# EAGLE design Controller (EAGLE 7.1.0)
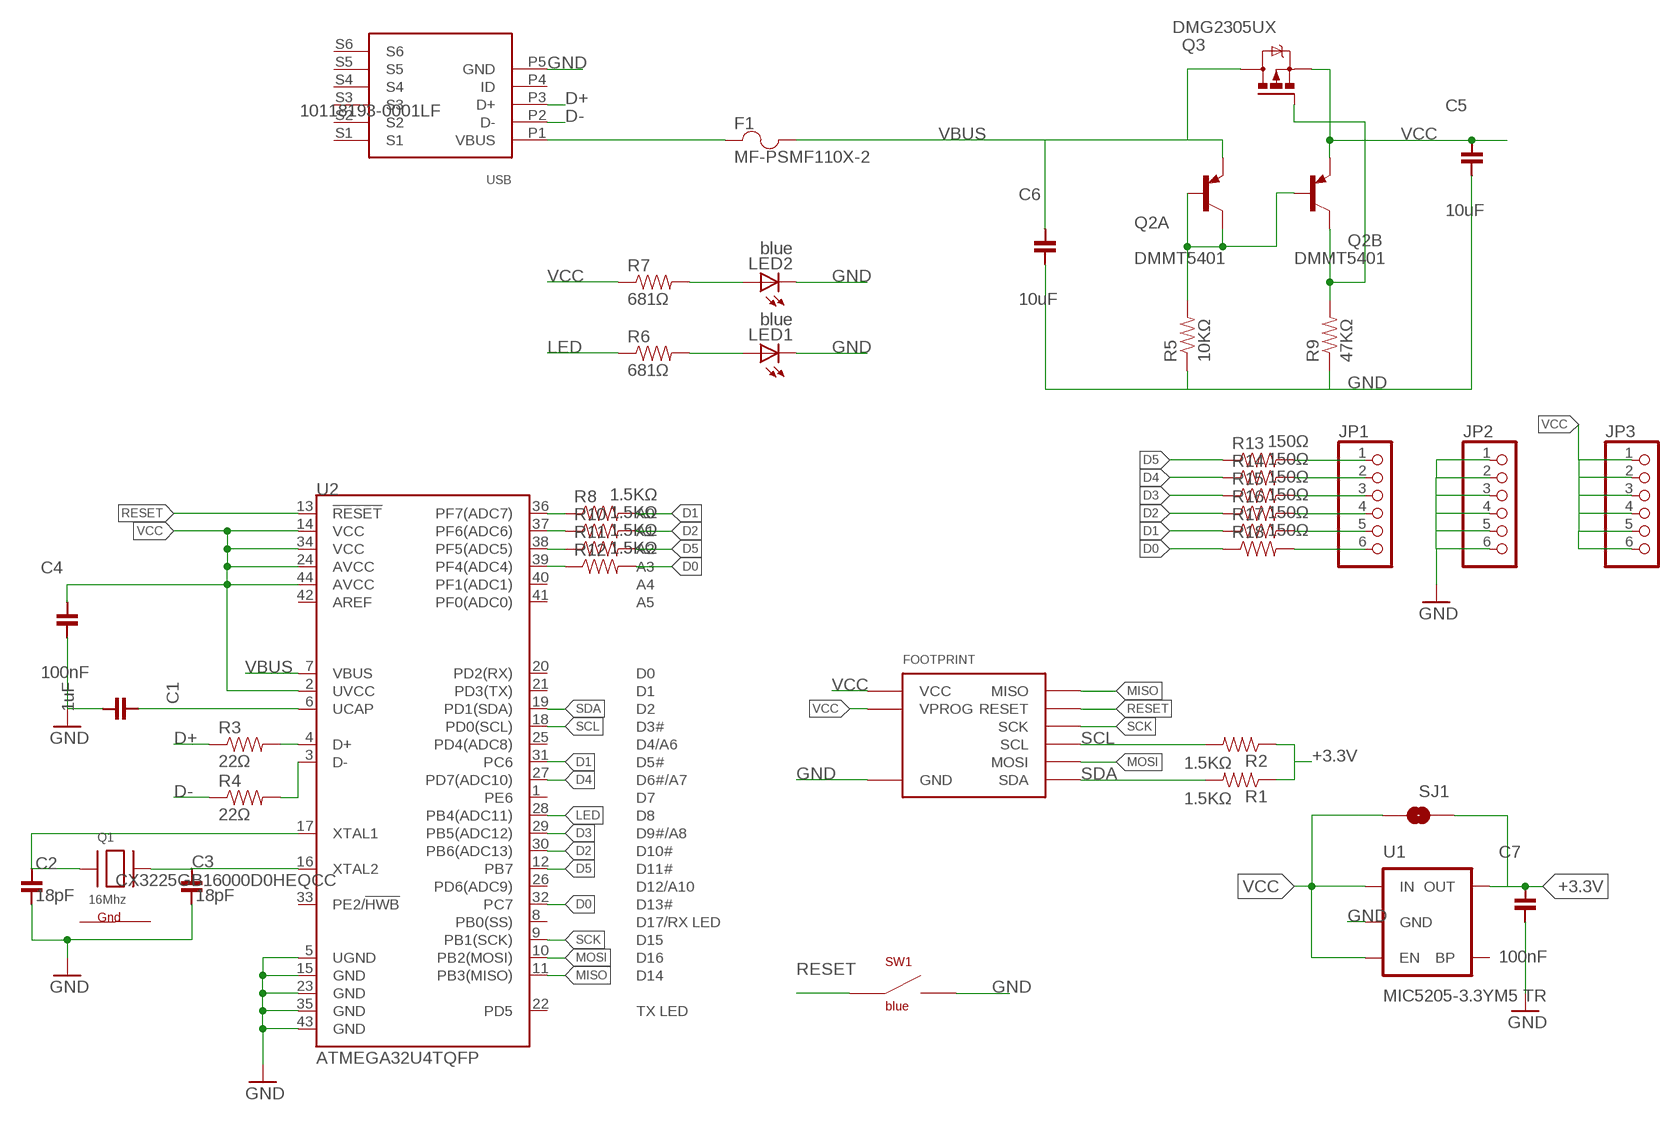
[diagram p0: schematic, sheet 1]

## Parts
C1  1uF  CAPACITOR-1UF  [0603]
C2  18pF  CAPACITOR-18PF  [0603]
C3  18pF  CAPACITOR-18PF  [0603]
C4  100nF  CAPACITOR-100NF  [0603]
C5  10uF  CAPACITOR-10UF  [0603]
C6  10uF  CAPACITOR-10UF  [0603]
C7  100nF  CAPACITOR-100NF  [0603]
F1  MF-PSMF110X-2  FUSE  [0805]
FOOTPRINT  DEVICE-PCB-TABS  [DEVICE-PCB-TABS]
JP1  PINHD-1X6LOCK  [1X06-BIGLOCK]
JP2  PINHD-1X6LOCK  [1X06-BIGLOCK]
JP3  PINHD-1X6LOCK  [1X06-BIGLOCK]
LED1  blue  LED-0805-BLUE  [0805-LED]
LED2  blue  LED-0805-BLUE  [0805-LED]
Q1  16Mhz  CRYSTAL-NX3225  [NX3225]
Q2  DMMT5401  TRANSISTOR-DUAL-PNP  [SOT-26]
Q3  DMG2305UX  IRLML5203  [MICRO3]
R1  1.5KΩ  RESISTOR-1.5KΩ  [0603]
R2  1.5KΩ  RESISTOR-1.5KΩ  [0603]
R3  22Ω  RESISTOR-22Ω  [0603]
R4  22Ω  RESISTOR-22Ω  [0603]
R5  10KΩ  RESISTOR-10KΩ  [0603]
R6  681Ω  RESISTOR-681Ω  [0603]
R7  681Ω  RESISTOR-681Ω  [0603]
R8  1.5KΩ  RESISTOR-1.5KΩ  [0603]
R9  47KΩ  RESISTOR-47KΩ  [0603]
R10  1.5KΩ  RESISTOR-1.5KΩ  [0603]
R11  1.5KΩ  RESISTOR-1.5KΩ  [0603]
R12  1.5KΩ  RESISTOR-1.5KΩ  [0603]
R13  150Ω  RESISTOR-150Ω  [0603]
R14  150Ω  RESISTOR-150Ω  [0603]
R15  150Ω  RESISTOR-150Ω  [0603]
R16  150Ω  RESISTOR-150Ω  [0603]
R17  150Ω  RESISTOR-150Ω  [0603]
R18  150Ω  RESISTOR-150Ω  [0603]
SJ1  SOLDERJUMPERNO  [SJ_2S-NO]
SW1  blue  SWITCHBOURNS-7914J  [BOURNS-7914J]
U1  MIC5205-3.3YM5 TR  VREG-MIC5205-3.3V  [SOT23-5]
U2  ATMEGA32U4TQFP  [SPARKFUN-DIGITALIC_TQFP44]
U3  USBFCI-MICROB  [USB-MICROB-FCI]

## Nets
+3.3V: C7.1 R1.1 R2.1 SJ1.2 U1.5(OUT)
D0: R12.2 R18.1 U2.32(PC7)
D1: R8.2 R17.1 U2.31(PC6)
D2: R10.2 R16.1 U2.30(PB6(ADC13))
D3: R15.1 U2.29(PB5(ADC12))
D4: R14.1 U2.27(PD7(ADC10))
D5: R11.2 R13.1 U2.12(PB7)
D+: R3.1 U3.P3(D+)
D-: R4.1 U3.P2(D-)
GND: C1.2 C2.2 C3.2 C4.2 C5.2 C6.2 C7.2 FOOTPRINT.BUS0(GND) JP2.1 JP2.2 JP2.3 JP2.4 JP2.5 JP2.6 LED1.C LED2.C R5.1 R9.1 SW1.NEG$1(NEG1) SW1.NEG$2(NEG1) U1.2(GND) U2.5(UGND) U2.15(GND) U2.23(GND) U2.35(GND) U2.43(GND) U3.P5(GND)
LED: R6.1 U2.28(PB4(ADC11))
MISO: FOOTPRINT.PROG3(MISO) U2.11(PB3(MISO))
MOSI: FOOTPRINT.PROG4(MOSI) U2.10(PB2(MOSI))
N$1: C1.1 U2.6(UCAP)
N$2: JP1.1 R13.2
N$3: F1.1 U3.P1(VBUS)
N$4: C3.1 Q1.3(X2) U2.16(XTAL2)
N$5: LED1.A R6.2
N$6: R12.1 U2.39(PF4(ADC4))
N$7: R11.1 U2.38(PF5(ADC5))
N$8: R3.2 U2.4(D+)
N$9: R4.2 U2.3(D-)
N$10: R10.1 U2.37(PF6(ADC6))
N$11: R8.1 U2.36(PF7(ADC7))
N$12: LED2.A R7.2
N$13: JP1.2 R14.2
N$14: Q2.1(A:C) Q2.2(A:B) Q2.3(B:B) R5.2
N$15: C2.1 Q1.1(X1) U2.17(XTAL1)
N$16: Q2.4(B:C) Q3.1(G) R9.2
N$17: JP1.3 R15.2
N$18: JP1.4 R16.2
N$19: JP1.5 R17.2
N$20: JP1.6 R18.2
RESET: FOOTPRINT.PROG1(RESET) SW1.POS$1(POS1) SW1.POS$2(POS1) U2.13(!RESET)
SCK: FOOTPRINT.PROG2(SCK) U2.9(PB1(SCK))
SCL: FOOTPRINT.BUS3(SCL) R2.2 U2.18(PD0(SCL))
SDA: FOOTPRINT.BUS1(SDA) R1.2 U2.19(PD1(SDA))
VBUS: C6.1 F1.2 Q2.6(A:E) Q3.3(D) U2.7(VBUS)
VCC: C4.1 C5.1 FOOTPRINT.BUS2(VCC) FOOTPRINT.PROG0(VPROG) JP3.1 JP3.2 JP3.3 JP3.4 JP3.5 JP3.6 Q2.5(B:E) Q3.2(S) R7.1 SJ1.1 U1.1(IN) U1.3(EN) U2.2(UVCC) U2.14(VCC) U2.24(AVCC) U2.34(VCC) U2.44(AVCC)
Unconnected: U1.4(BP) U2.1(PE6) U2.8(PB0(SS)) U2.20(PD2(RX)) U2.21(PD3(TX)) U2.22(PD5) U2.25(PD4(ADC8)) U2.26(PD6(ADC9)) U2.33(PE2/!HWB) U2.40(PF1(ADC1)) U2.41(PF0(ADC0)) U2.42(AREF) U3.P4(ID) U3.S1 U3.S2 U3.S3 U3.S4 U3.S5 U3.S6

## Power pins joined to a net without a drawn wire
G1: Q1.2(G1)
G2: Q1.4(G2)

## Library data of the parts
C1 = Modulo:CAPACITOR: Capacitor; PARTNUM: C0603C105K4RACTU
C2 C3 = Modulo:CAPACITOR: Capacitor; PARTNUM: C0603C180J5GACTU
C4 C7 = Modulo:CAPACITOR: Capacitor; PARTNUM: C0603C104K5RACTU
C5 C6 = Modulo:CAPACITOR: Capacitor; PARTNUM: GRM188R60J106ME47D
F1 = Modulo:FUSE; PARTNUM: MF-PSFM110X-2
FOOTPRINT = Modulo:DEVICE-PCB: Modulo Footprint
JP1-JP3 = adafruit:PINHD-1X6: PIN HEADER; PARTNUM: PREC006SAAN-RC
LED1 LED2 = Modulo:LED: LED; PARTNUM: LTST-C171TBKT
Q1 = Modulo:CRYSTAL; PARTNUM: CX3225GB16000D0HEQCC
Q2 = IntegerLabs:TRANSISTOR-DUAL-PNP: PNP Transistor; PARTNUM: DMMT5401
Q3 = transistor-power:IRLML5203: HEXFET P-Channel Power MOSFET; PARTNUM: DMG2305UX
R1 R2 R8 R10-R12 = Modulo:RESISTOR: Resistor Basic schematic elements and footprints for 0603, 1206, and PTH resistors.; PARTNUM: ERJ-3EKF1501V
R3 R4 = Modulo:RESISTOR: Resistor Basic schematic elements and footprints for 0603, 1206, and PTH resistors.; PARTNUM: ERJ-3EKF22R0V
R5 = Modulo:RESISTOR: Resistor Basic schematic elements and footprints for 0603, 1206, and PTH resistors.; PARTNUM: ERJ-3EKF1002V
R6 R7 = Modulo:RESISTOR: Resistor Basic schematic elements and footprints for 0603, 1206, and PTH resistors.; PARTNUM: ERJ-3EKF6810V
R9 = Modulo:RESISTOR: Resistor Basic schematic elements and footprints for 0603, 1206, and PTH resistors.; PARTNUM: ERJ-3EKF4702V
R13-R18 = Modulo:RESISTOR: Resistor Basic schematic elements and footprints for 0603, 1206, and PTH resistors.; PARTNUM: ERJ-3EKF1500V
SJ1 = SparkFun-Passives:SOLDERJUMPER: Solder Jumper Standard SMD solder jumper. Used to automate production. Two varients : Normally Open and Normally Closed are the same, but have different paste layers. NC will have a large amount of paste and should jumper during reflow.; PARTNUM: EXCLUDE
SW1 = Modulo:SWITCH; PARTNUM: 7914J-1-000E
U1 = Modulo:VREG-MIC5205: V_REG MIC5219 Standard 3.3V and 5V 150mA LDO voltage regulator in SOT-23 layout. Micrel part MIC5205. BP (by-pass) pin is used to lower output noise with 470pF cap, may be left open.; PARTNUM: MIC5205-3.3YM5 TR
U2 = SparkFun-DigitalIC:ATMEGA32U4: Atmel 44-pin 8-bit Microcontroller with 32KBytes of ISP Flash and USB Controller ----- Please use the QFN-44-NOPAD_1:1 package for the footprint of all boards using a 32U4. Route traces directly away from the pads as much as possible.; PARTNUM: ATMEGA32U4TQFP; PROD_ID: IC-11161
U3 = IntegerLabs:USB; PARTNUM: 10118193-0001LF

## Board
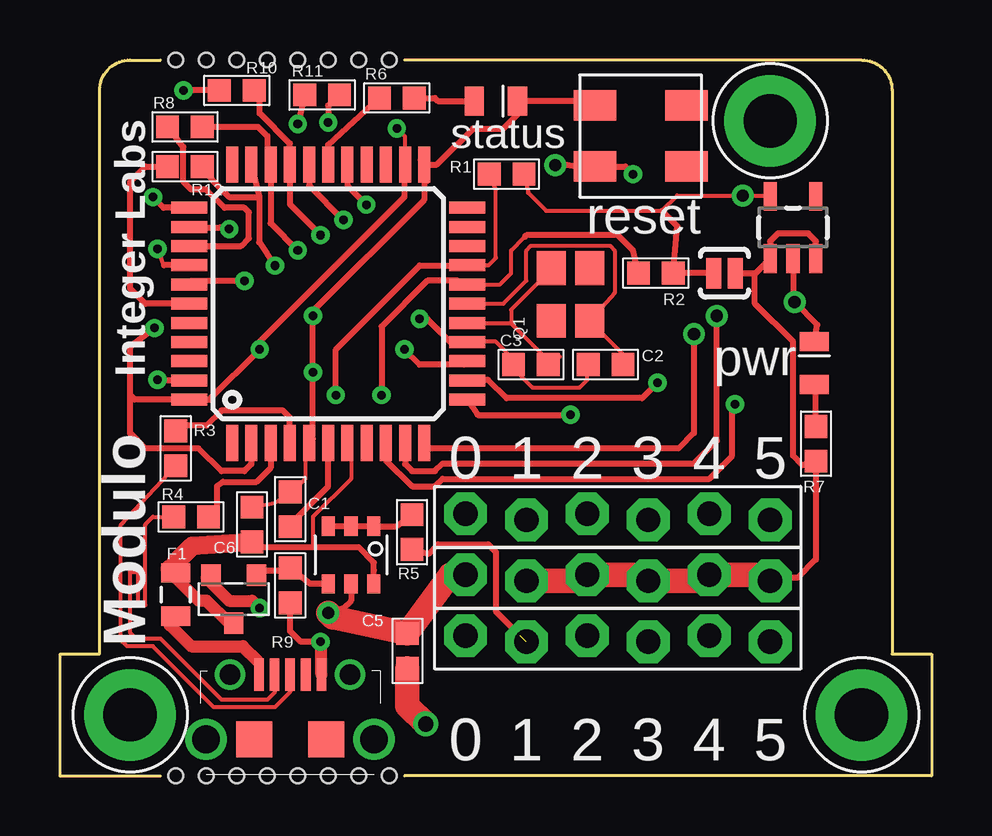
[diagram p1: board, top side]
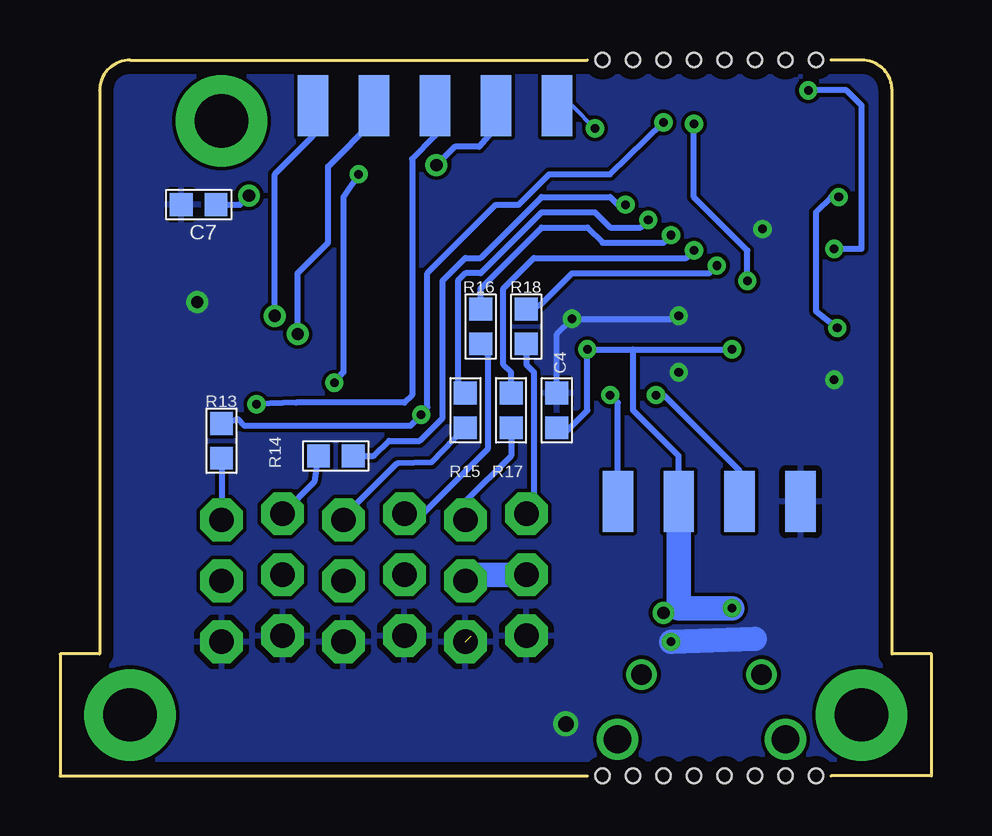
[diagram p2: board, bottom side, seen from below]

Size 36.32 x 29.84 mm. Coordinates in mm from the lower left corner, seen from the top.
Copper layers (1*16): Top 0.0178mm / dielectric 59mil / Bottom 0.0178mm
Design rules "SSC-EAGLE-2Lyr_v1.0.0.3": minimum track width 6mil, minimum drill 14mil, track to track 6mil, track to pad 6mil, pad to pad 6mil, via to via 6mil, smd to smd 6mil, copper to edge 20mil, drill to drill 16mil, minimum pad ring 8mil, minimum via ring 8mil, stop-mask expansion 3mil, vias tented up to drill 0mil, thermal gap 10mil

### Footprints (pad centres in the part's own frame; a part is rotated, then mirrored left to right if it is on the bottom)
0603 = smd 0.95 x 0.95: 1 -0.725,0; 2 0.725,0
0805 = smd 0.8 x 1.2: 1 -0.9,0; 2 0.9,0
DEVICE-PCB-TABS = smd 1.27 x 2.54 bottom: BUS0 5.08,11.43; BUS1 7.62,11.43; BUS2 10.16,11.43; BUS3 12.7,11.43; PROG0 15.24,27.94; PROG1 17.78,27.94; PROG2 20.32,27.94; PROG3 22.86,27.94; PROG4 25.4,27.94 | drill 2.223 pad 3.81: P$1 2.54,2.54; P$2 33.02,2.54; P$3 29.21,27.305 | hole 0.6: 4.445,29.845; 5.715,29.845; 6.985,29.845; 8.255,29.845; 9.525,29.845; 10.795,29.845; 12.065,29.845; 13.335,29.845; 4.445,0; 5.715,0; 6.985,0; 8.255,0; 9.525,0; 10.795,0; 12.065,0; 13.335,0
1X06-BIGLOCK = drill 1.016 pad 1.778 octagon: 1 -6.35,0.127; 2 -3.81,-0.127; 3 -1.27,0.127; 4 1.27,-0.127; 5 3.81,0.127; 6 6.35,-0.127
0805-LED = smd 1.2 x 0.8: A 0,-0.9; C 0,0.9
NX3225 = smd 1.4 x 1.2: 1 -1.1,-0.8; 2 1.1,-0.8; 3 1.1,0.8; 4 -1.1,0.8
SOT-26 = smd 0.55 x 0.8: 1 -0.95,-1.2; 2 0,-1.2; 3 0.95,-1.2; 4 0.95,1.2; 5 0,1.2; 6 -0.95,1.2
MICRO3 = smd 0.8 x 0.9: 1 -0.95,-1; 2 0.95,-1; 3 0,1
SJ_2S-NO = smd 0.635 x 1.27: 1 -0.45,0; 2 0.45,0
BOURNS-7914J = smd 1.27 x 1.778: NEG$1 1.27,1.905; NEG$2 1.27,-1.905; POS$1 -1.27,1.905; POS$2 -1.27,-1.905
SOT23-5 = smd 0.55 x 1.2: 1 -0.95,-1.3; 2 0,-1.3; 3 0.95,-1.3; 4 0.95,1.3; 5 -0.95,1.3
SPARKFUN-DIGITALIC_TQFP44 = smd 1.5 x 0.5: 1 -5.8,4; 2 -5.8,3.2; 3 -5.8,2.4; 4 -5.8,1.6; 5 -5.8,0.8; 6 -5.8,0; 7 -5.8,-0.8; 8 -5.8,-1.6; 9 -5.8,-2.4; 10 -5.8,-3.2; 11 -5.8,-4; 23 5.8,-4; 24 5.8,-3.2; 25 5.8,-2.4; 26 5.8,-1.6; 27 5.8,-0.8; 28 5.8,0; 29 5.8,0.8; 30 5.8,1.6; 31 5.8,2.4; 32 5.8,3.2; 33 5.8,4 | smd 0.5 x 1.5: 12 -4,-5.8; 13 -3.2,-5.8; 14 -2.4,-5.8; 15 -1.6,-5.8; 16 -0.8,-5.8; 17 0,-5.8; 18 0.8,-5.8; 19 1.6,-5.8; 20 2.4,-5.8; 21 3.2,-5.8; 22 4,-5.8; 34 4,5.8; 35 3.2,5.8; 36 2.4,5.8; 37 1.6,5.8; 38 0.8,5.8; 39 0,5.8; 40 -0.8,5.8; 41 -1.6,5.8; 42 -2.4,5.8; 43 -3.2,5.8; 44 -4,5.8
USB-MICROB-FCI = smd 0.4 x 1.35: P1 -1.3,2.7; P2 -0.65,2.7; P3 0,2.7; P4 0.65,2.7; P5 1.3,2.7 | drill 0.85: S1 -2.5,2.7; S2 2.5,2.7 | drill 1.15: S3 -3.5,0; S6 3.5,0 | smd 1.5 x 1.5: S4 -1.5,0; S5 1.5,0

### Placement (x,y rotation side)
C1  9.59,11.11 90 top
C2  22.73,17.14 180 top
C3  19.62,17.14 180 top
C4  15.62,15.24 90 bottom
C5  14.48,5.21 270 top
C6  8,10.48 90 top
C7  30.54,23.81 180 bottom
F1  4.83,7.56 90 top
FOOTPRINT  0.38,0 0 top
JP1  23.24,10.79 180 top
JP2  23.24,5.71 0 top
JP3  23.24,8.26 0 top
LED1  18.16,28.13 270 top
LED2  31.43,17.21 0 top
Q1  21.27,20.07 90 top
Q2  12.13,9.21 180 top
Q3  7.24,7.37 180 top
R1  18.61,25.08 180 top
R2  24.83,20.95 180 top
R3  4.83,13.65 90 top
R4  5.46,10.79 0 top
R5  14.67,10.16 90 top
R6  14.03,28.26 0 top
R7  31.5,13.84 90 top
R8  5.21,27.05 0 top
R9  9.59,7.94 90 top
R10  7.37,28.57 0 top
R11  10.92,28.38 0 top
R12  5.21,25.4 0 top
R13  29.59,13.97 270 bottom
R14  24.83,13.34 180 bottom
R15  19.43,15.24 270 bottom
R16  18.8,18.73 270 bottom
R17  17.53,15.24 270 bottom
R18  16.89,18.73 270 bottom
SJ1  27.69,20.95 180 top
SW1  24.19,26.67 90 top
U1  30.54,22.86 0 top
U2  11.18,19.68 90 top
U3  9.59,1.52 0 top

### Tracks (layer width: path | path; a pad name or v marks a point on that pad's centre or on a via)
+3.3V  (via drill 0.51)
  Top 0.159: R1.1 19.51,24.31 20.26,23.56 25.08,23.56 25.72,24.19 v28.45,24.19 29.56,24.19 U1.5
  Top 0.254: 25.08,23.56 25.73,22.91 R2.1 SJ1.2
  Bottom 0.254: C7.1 28.83,23.81 v28.45,24.19
D0  (via drill 0.36)
  Top 0.254: U2.32 8.29,24.13 | 8.29,24.13 8.29,22.25 v8.95,21.27 | R12.2 6.36,24.82 7.05,24.13 8.29,24.13
  Bottom 0.254: R18.1 16.31,19.63 14.99,20.95 9.27,20.95 v8.95,21.27
D1  (via drill 0.36)
  Top 0.159: 8.64,25.62 U2.31
  Top 0.254: R8.2 8.25,27.05 8.64,26.67 8.64,25.62 | U2.31 8.78,23.04 v9.91,21.91
  Bottom 0.254: v9.91,21.91 10.22,21.59 16.57,21.59 17.84,20.32 17.84,17.14 17.53,16.83 R17.1
D2  (via drill 0.36)
  Top 0.159: 8.32,28.57 R10.2
  Top 0.254: 8.32,28.57 8.32,27.62 9.58,26.36 U2.30 9.58,23.82 v10.86,22.54
  Bottom 0.254: v10.86,22.54 11.18,22.23 13.72,22.23 14.35,22.86 16.26,22.86 18.8,20.32 R16.1
D3  (via drill 0.36)
  Top 0.254: U2.29 10.38,24.61 v11.81,23.18
  Bottom 0.254: v11.81,23.18 12.13,22.86 13.4,22.86 14.03,23.5 16.26,23.5 18.8,20.95 19.43,20.95 19.75,20.64 19.75,16.46 R15.1
D4  (via drill 0.36)
  Top 0.254: U2.27 11.98,24.6 v12.76,23.81
  Bottom 0.254: v12.76,23.81 13.08,23.81 13.4,24.13 16.26,24.13 18.8,21.59 19.43,21.59 20.38,20.64 20.38,14.92 21.34,13.97 22.61,13.97 23.24,13.34 R14.1
D5  (via drill 0.36)
  Top 0.159: R11.2 11.49,28.26
  Top 0.254: 11.49,28.26 11.18,27.94 v11.18,27.24 | U2.12 17.4,15.05 v21.27,15.05
  Bottom 0.254: v11.18,27.24 13.4,25.08 15.94,25.08 17.21,23.81 18.16,23.81 21.02,20.95 21.02,15.37 v21.27,15.05 21.72,14.61 28.64,14.61 28.9,14.87 R13.1
D+
  Top 0.159: U3.P3 9.59,3.49 8.95,2.86 6.41,2.86 3.87,5.4 2.79,5.4 2.54,5.65 2.54,10.47 R3.1
D-
  Top 0.159: U3.P2 8.94,3.48 8.64,3.17 6.73,3.17 4.19,5.71 3.17,5.71 2.92,5.97 2.92,8.51 3.24,8.51 3.24,7.11 3.56,7.11 3.56,10.48 3.87,10.79 R4.1
GND  (via drill 0.36, 0.51, 0.64)  (1 unrouted)
  Top 0.159: U2.23 15.18,24.77 15.3,24.77 15.18,24.89 U2.23 | 16.96,18.1 U2.15 | 19.11,27.62 19.11,27.84 LED1.C | 14.99,25.68 U2.23 | 10.54,14.05 U2.5 10.22,13.65 10.22,12.38 9.85,12.01 C1.2 8.95,11.38 C6.2 | v10.54,19.18 10.54,19.37 | U2.15 16.27,18.09 | C2.2 21.97,17.03 21.97,16.51 21.65,16.19 19.68,16.19 18.73,17.14 C3.2 19.04,17.22 18.16,18.1 16.99,18.1 U2.15
  Top 0.254: 15.18,24.77 15.18,24 10.54,19.37 | SW1.NEG$1 22.1,28.13 LED1.C | 5.35,22.86 6.67,22.86 v7.05,22.8 | U2.43 4.41,16.48 3.84,16.49 3.84,16.48 v4.06,16.51 | 10.54,14.05 v10.54,16.83 v10.54,19.18 | 16.27,18.09 15.3,19.05 v14.99,19.05 | v10.86,5.59 10.03,5.59 9.59,6.03 R9.1 | U1.2 30.54,19.81 v30.61,19.75 31.56,18.8 LED2.C | R5.1 15.36,9.26 15.75,9.65 17.84,9.65 18.16,9.34 18.16,6.86 19.18,5.84 | U2.23 15.71,25.48 17.21,26.99 18.48,26.99 19.11,27.62
  Top 0.381: U2.43 5.44,16.48 | 5.35,22.86 U2.35
  Top 0.508: U3.P5 10.89,5.56 v10.86,5.59
  Top 1.016: C5.2 14.48,2.92 v15.24,2.16
  Bottom 0.254: FOOTPRINT.BUS0 5.46,12.38 | v10.54,19.18 10.67,19.05 v14.99,19.05 15.62,18.41 C4.2
  Bottom 1.016: v10.86,5.59 7.37,5.71
  pour Bottom: -0.89,0 35.94,0 35.94,30.48 -0.89,30.48
LED
  Top 0.254: U2.28 11.18,26.3 R6.1
MISO  (via drill 0.51)
  Top 0.159: 15.26,13.65 U2.11
  Top 0.254: v26.42,18.41 26.42,14.29 25.78,13.65 15.41,13.65 U2.11
  Bottom 0.254: v26.42,18.41 26.42,20.95 25.15,22.23 25.15,25.4 23.24,27.3 FOOTPRINT.PROG3
MOSI  (via drill 0.51)
  Top 0.159: 14.35,13.86 U2.10
  Top 0.254: U2.10 14.38,12.99 14.67,12.7 15.62,12.7 15.94,13.02 26.42,13.02 27.37,13.97 v27.37,19.18
  Bottom 0.159: FOOTPRINT.PROG4 25.78,26.67
  Bottom 0.254: 25.78,26.67 27.37,25.08 v27.37,19.18
N$1
  Top 0.159: C1.1 9.64,10.53
  Top 0.254: 9.64,10.53 11.18,12.06 U2.6
N$2
  Bottom 0.254: R13.2 JP1.1
N$3
  Top 0.254: 8.25,4.76 8.32,4.32 U3.P1
  Top 0.508: 8.25,4.76 7.62,5.4 5.46,5.4 4.57,6.29 F1.1
N$4
  Top 0.159: C3.1 20.84,17.47 20.18,17.47 18.8,18.86 | 18.8,18.86 17,18.86 U2.16 | Q1.3 20.47,21.11 18.8,19.43 18.8,18.86
N$5
  Top 0.254: R6.2 15.62,28.26 15.75,28.13 LED1.A
N$6
  Top 0.254: U2.39 3.56,19.68 2.92,20.32 2.92,24.77 3.56,25.4 R12.1
N$7  (via drill 0.36)
  Top 0.159: U2.38 5.46,20.64
  Top 0.254: 5.46,20.64 v7.68,20.64 | R11.1 v9.91,27.18
  Bottom 0.254: v7.68,20.64 7.68,21.91 9.91,24.13 v9.91,27.18
N$8
  Top 0.254: U2.4 9.58,14.94 9.27,15.24 6.73,15.24 6.1,14.61 4.88,14.61 R3.2
N$9
  Top 0.254: U2.3 8.78,12.84 8.19,12.26 6.79,12.26 6.54,12.06 6.54,10.79 6.03,10.79 6.35,10.81 R4.2
N$10  (via drill 0.36)
  Top 0.159: 4.33,21.29 v4.06,21.97
  Top 0.254: U2.37 4.33,21.29 | R10.1 v5.14,28.57
  Bottom 0.254: v4.06,21.97 2.92,21.97 2.92,27.94 3.56,28.57 v5.14,28.57
N$11
  Top 0.254: U2.36 7.54,22.09 7.87,22.42 7.87,23.5 7.68,23.69 6.86,23.69 6.1,24.45 5.46,24.45 5.14,24.77 5.14,26.21 R8.1
N$12
  Top 0.254: R7.2 31.5,15.97 LED2.A
N$13
  Bottom 0.254: R14.2 25.73,12.24 JP1.2
N$14
  Top 0.254: Q2.3 Q2.2 Q2.1 14.02,10.41 R5.2
N$15
  Top 0.159: U2.17 18.48,19.68 19.43,20.64 19.43,21.91 19.62,22.1 22.92,22.1 23.11,21.91 23.11,20.13 Q1.1 23.63,17.41 C2.1
N$16
  Top 0.159: Q3.1 8,8.57 | 9.27,8.57 R9.2
  Top 0.254: 8,8.57 9.27,8.57 | Q2.4 10.42,8.01 R9.2
N$17
  Bottom 0.254: R15.2 20.84,13.07 22.29,13.02 24.51,10.79 JP1.3
N$18
  Bottom 0.254: JP1.4 21.21,10.92 18.48,13.65 18.48,17.52 R16.2
N$19
  Bottom 0.254: R17.2 17.53,13.34 19.43,11.43 JP1.5
N$20
  Bottom 0.254: R18.2 16.89,17.14 16.57,16.83 16.57,11.24 JP1.6
RESET  (via drill 0.36, 0.51)
  Top 0.159: 17,16.51 U2.13
  Top 0.254: v24.89,16.38 24.26,15.75 18.61,15.75 17.84,16.51 17,16.51 | v20.64,25.46 21.15,25.46 21.46,25.4 SW1.POS$1 23.56,25.4 v23.88,25.08
  Bottom 0.254: FOOTPRINT.PROG1 18.16,26.99 18.48,26.67 18.86,26.23 19.88,26.23 v20.64,25.46 | v23.88,25.08 24.51,24.13 24.51,16.83 24.57,16.76 v24.89,16.38
SCK  (via drill 0.36)
  Top 0.159: U2.9 13.58,13.16
  Top 0.254: 13.58,13.16 14.67,12.06 15.62,12.06 15.94,12.38 27.05,12.38 28,13.34 28,15.37 v28.13,15.49
  Bottom 0.254: FOOTPRINT.PROG2 20.7,26.67 21.65,25.72 21.65,15.88 21.97,15.56 26.48,15.56 v28.13,15.49
SCL  (via drill 0.36)
  Top 0.159: U2.18 17.04,20.48 | 17.04,20.48 16.57,20.64 | 17.04,20.48 18.33,20.48 18.8,20.95 18.8,21.91 19.37,22.48
  Top 0.254: 16.57,20.64 15.3,20.64 13.4,18.73 v13.4,15.88 | R2.2 23.88,21.91 23.24,22.54 19.43,22.54 19.37,22.48
  Bottom 0.254: FOOTPRINT.BUS3 13.08,15.56 v13.4,15.88
SDA  (via drill 0.36)
  Top 0.159: U2.19 17.86,21.29 18.16,21.59 18.16,24.46 R1.2
  Top 0.254: v11.49,15.88 11.49,17.78 14.99,21.27 16.96,21.27 U2.19
  Bottom 0.254: FOOTPRINT.BUS1 8,12.7 11.18,15.88 v11.49,15.88
VBUS
  Top 0.159: 8.05,9.53 C6.1 | U2.7 12.13,13.73 12.13,12.38 10.54,10.79 10.54,9.53
  Top 0.254: Q2.6 13.08,8.57 13.08,8.88 12.45,9.53 10.54,9.53 8.05,9.53 | 4.83,8.89 F1.2 4.57,8.32
  Top 0.508: Q3.3 7.03,6.37 6.1,7.3 5.78,7.3 4.83,8.26 4.57,8.32
  Top 0.762: C6.1 5.51,9.58 4.83,8.89 | F1.2 4.57,8.64
VCC  (via drill 0.36, 0.51)
  Top 0.159: U2.14 16.57,17.14 | U2.24 14.38,25.43 14.35,25.4 14.35,25.08 | U2.14 16.4,17.29 | 16.84,17.14 U2.14 | 14.35,25.51 U2.24 | 8,13.86 U2.2 | U2.34 4.64,23.68 | U2.24 14.38,26.64 v14.03,26.99
  Top 0.254: 16.84,17.14 14.99,17.14 v14.35,17.78 | 4.64,23.68 4.32,23.69 v3.87,24.13 | Q3.2 6.1,8.25 | 14.35,25.08 14.35,24.13 8.32,18.1 v8.32,17.78 6.22,15.69 U2.44 3.11,15.69 2.92,15.88 | U1.3 31.49,22.29 31.18,22.61 29.91,22.61 29.59,22.29 U1.1 28.99,20.95 | U2.2 7.98,12.99 7.68,12.7 6.73,12.7 5.78,13.65 3.56,13.65 2.92,14.29 2.92,15.88 | Q2.5 12.13,7.3 11.81,6.99 v11.18,6.79 | 2.92,15.88 2.92,17.91 v3.94,18.67 | JP3.6 29.72,8.26 30.73,8.26 31.5,9.02 R7.1 30.94,12.94 30.54,13.34 30.54,18.1 28.96,19.68 28.96,20.92 28.99,20.95 | SJ1.1 28.99,20.95
  Top 0.381: U2.34 5.38,23.73
  Top 0.508: 6.1,8.25 7.05,7.3 8,7.3 v8.32,6.99
  Top 1.016: JP3.6 29.34,8.38 JP3.5 26.8,8.13 JP3.4 24.26,8.38 JP3.3 21.72,8.13 JP3.2 | JP3.1 16.25,8.38 C5.1 11.36,6.61 v11.18,6.79
  Bottom 0.159: FOOTPRINT.PROG0 14.99,27.94 v14.03,26.99
  Bottom 0.254: 12.45,17.78 v14.35,17.78 14.35,15.24 15.25,14.34 C4.1 | 12.45,17.78 v8.32,17.78 | FOOTPRINT.BUS2 10.54,13.34 12.45,15.24 12.45,17.78 | 10.54,6.99 v11.18,6.79 | v3.87,24.13 4.19,24.13 4.83,23.5 4.83,19.37 v3.94,18.67
  Bottom 0.762: 10.54,11.11 FOOTPRINT.BUS2
  Bottom 1.016: 10.54,11.11 10.54,6.99 v8.32,6.99 | JP3.2 19.18,8.38 JP3.1

### Text on the board
tPlace: status | reset | pwr | 0 | 1 | 2 | 3 | 4 | 5 | 0 | 1 | 2 | 3 | 4 | 5